# Altium project FC.PrjPcb
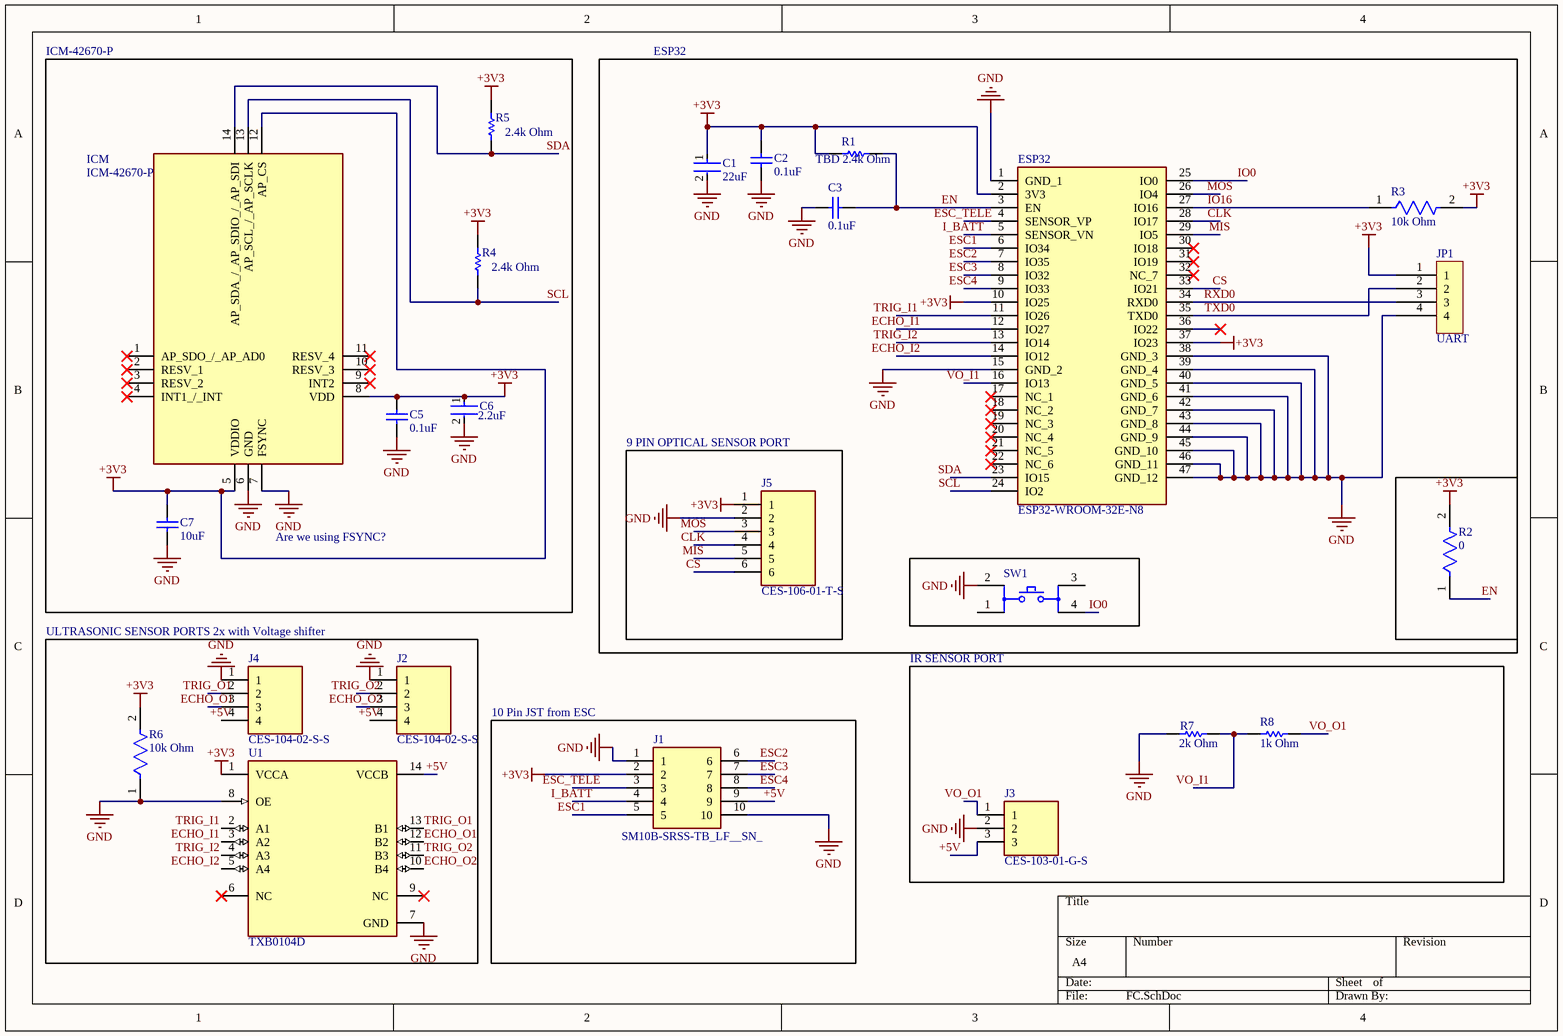
[diagram p0: FC.SchDoc]
1 sheet, 24 parts. Net scope: global (net labels, ports and power ports of the same name join across sheets).
Board file: FC.PcbDoc

## Sheet FC.SchDoc
size A4

### Parts
C1  22uF  [FP-CL10-IPC_B]
C2  0.1uF  [CAPC0805(2012)145_M]
C3  0.1uF  [CAPC0805(2012)145_M]
C5  0.1uF  [CAPC0805(2012)145_M]
C6  2.2uF  [FP-CC0603-DA-MFG]
C7  10uF  [CAPC2013X140X50ML20T25]
ESP32  ESP32-WROOM-32E-N8  [ESP32WROOM32EN8]
ICM  ICM-42670-P  [ICM42670P]
J1  SM10B-SRSS-TB_LF__SN_  [SM10B-SRSS-TB]
J2  CES-104-02-S-S  [CES-104-XX-Y-S]
J3  CES-103-01-G-S  [CES-103-XX-Y-S]
J4  CES-104-02-S-S  [CES-104-XX-Y-S]
J5  CES-106-01-T-S  [CES-106-XX-Y-S]
JP1  UART  [HDR Male1~4 2.54mm]
R1  TBD 2.4k Ohm  [RESC1608X55X30ML15T15]
R2  0  [FP-AC0603-IPC_A]
R3  10k Ohm  [FP-AC0603-IPC_A]
R4  2.4k Ohm  [RESC1608X55X30ML15T15]
R5  2.4k Ohm  [RESC1608X55X30ML15T15]
R6  10k Ohm  [FP-AC0603-IPC_A]
R7  2k Ohm  [RESC3116X65X40ML10T20]
R8  1k Ohm  [RESC3116X65X40ML10T20]
SW1  (no value)  [FP-TL3301AF160QG-MFG]
U1  TXB0104D  [FP-D0014A-IPC_A]

### Blocks framed on the sheet
ESP32: C1-C3 ESP32 JP1 R1-R3 SW1
9 PIN OPTICAL SENSOR PORT: J5
ULTRASONIC SENSOR PORTS 2x with Voltage shifter: J2 J4 R6 U1
IR SENSOR PORT: J3 R7 R8
10 Pin JST from ESC: J1

### Nets
+3V3: C1.1 C2.2 C5.2 C6.1 C7.2 ESP32.2(3V3) ESP32.10(IO25) ESP32.37(IO23) ICM.5(VDDIO) ICM.8(VDD) ICM.12(AP_CS) J1.2 J5.1 JP1.1 R1.2 R2.2 R3.2 R4.2 R5.1 R6.2 U1.1(VCCA)
GND: C1.2 C2.1 C3.2 C5.1 C6.2 C7.1 ESP32.1(GND_1) ESP32.15(GND_2) ESP32.38(GND_3) ESP32.39(GND_4) ESP32.40(GND_5) ESP32.41(GND_6) ESP32.42(GND_7) ESP32.43(GND_8) ESP32.44(GND_9) ESP32.45(GND_10) ESP32.46(GND_11) ESP32.47(GND_12) ICM.6(GND) ICM.7(FSYNC) J1.1 J1.10 J2.1 J3.2 J4.1 J5.2 JP1.4 R6.1 R7.1 SW1.2 U1.7(GND) U1.8(OE)
+5V: J1.9 J2.4 J3.3 J4.4 U1.14(VCCB)
CLK: ESP32.28(IO17) J5.4
CS: ESP32.33(IO21) J5.6
ECHO_I1: ESP32.12(IO27) U1.3(A2)
ECHO_I2: ESP32.14(IO12) U1.5(A4)
ECHO_O1: J4.3 U1.12(B2)
ECHO_O2: J2.3 U1.10(B4)
EN: C3.1 ESP32.3(EN) R1.1 R2.1
ESC1: ESP32.6(IO34) J1.5
ESC2: ESP32.7(IO35) J1.6
ESC3: ESP32.8(IO32) J1.7
ESC4: ESP32.9(IO33) J1.8
ESC_TELE: ESP32.4(SENSOR_VP) J1.3
I_BATT: ESP32.5(SENSOR_VN) J1.4
IO0: ESP32.25(IO0) SW1.4
IO16: ESP32.27(IO16) R3.1
MIS: ESP32.29(IO5) J5.5
MOS: ESP32.26(IO4) J5.3
RXD0: ESP32.34(RXD0) JP1.3
SCL: ESP32.24(IO2) ICM.13(AP_SCL_/_AP_SCLK) R4.1
SDA: ESP32.23(IO15) ICM.14(AP_SDA_/_AP_SDIO_/_AP_SDI) R5.2
TRIG_I1: ESP32.11(IO26) U1.2(A1)
TRIG_I2: ESP32.13(IO14) U1.4(A3)
TRIG_O1: J4.2 U1.13(B1)
TRIG_O2: J2.2 U1.11(B3)
TXD0: ESP32.35(TXD0) JP1.2
VO_I1: ESP32.16(IO13) R7.2 R8.1
VO_O1: J3.1 R8.2

Not connected (* = marked no-connect by the designer): ESP32 17(NC_1)* 18(NC_2)* 19(NC_3)* 20(NC_4)* 21(NC_5)* 22(NC_6)* 30(IO18)* 31(IO19)* 32(NC_7)* 36(IO22)*; ICM 1(AP_SDO_/_AP_AD0)* 2(RESV_1)* 3(RESV_2)* 4(INT1_/_INT)* 9(INT2)* 10(RESV_3)* 11(RESV_4)*; SW1 1 3; U1 6(NC)* 9(NC)*

### Notes on the sheet
- ICM-42670-P
- Are we using FSYNC?

### Library data of the parts
C1 = CMP-13271-002500-1: Cap Ceramic 22uF 6.3V X5R ±20% Pad SMD 0603 +85°C T/R
C2 C3 C5 = CMP-1036-04429-1: CAP 100nF 100V ±10% 0805 (2012 Metric) Thickness 1.45mm SMD; Tolerance: Â±10%; Case-Metric: 2012; Case-EIA: 0805; Rated Voltage: 100 V; Max Thickness: 1.45 mm; Technology: SMT; Value: 100nF
C6 = CMP-03422-000187-1: CC0603 2.2 uF X5R 10.00% 16 V; Manufacturer: YAGEO; Manufacturer Part Number: CC0603KPX5R7BB225; Voltage Rating: 16 V; Material: Ceramic; Tolerance: 0.1; Temperature Coefficient: 15%; ComponentLink2Description: Datasheet; Device Class L3: Ceramic Capacitors; Temperature Characteristic: X5R; Package: CC0603-DA; Automotive: No; Device Class L1: Passive Components; ComponentLink2URL: http://www.yageo.com/documents/recent/UPY-GPHC_X7R_6.3V-to-50V_18.pdf; Value: 2.2 uF; RoHS: TRUE; Height: 0.9mm; Temperature Range High: +125°C; Footprint Url: http://www.yageo.com/exep/pages/download/literatures/UPY-C_GEN_24.pdf; Lead Free: Yes; Temperature Range Low: -55°C; Capacitance: 2.2 uF; Octopart: https://octopart.com/cc0603kpx5r7bb225-yageo-91091799; Device Class L2: Capacitors; Voltage: 16 V; Temperature: -55°C to +125°C; Category: Cap
C7 = CMP-2007-04644-1: Part Number: 08056D106KAT4A; Manufacturer: AVX Interconnect / Elco
ESP32 = ESP32-WROOM-32E-N8: WiFi Modules - 802.11 SMD Module ESP32-WROOM-32E, ESP32-D0WD-V3, 8 MB SPI flash, PCB antenna; Manufacturer_Name: Espressif Systems; Geometry.Height: 3.25mm; Mouser Part Number: 356-ESP32WRM32E164PH; Mouser Price/Stock: https://www.mouser.co.uk/ProductDetail/Espressif-Systems/ESP32-WROOM-32E-N8?qs=Li%252BoUPsLEnsLnZW%252BGLgUhw%3D%3D; Manufacturer_Part_Number: ESP32-WROOM-32E-N8; Datasheet Link: https://www.google.com/url?sa=t&rct=j&q=&esrc=s&source=web&cd=&ved=2ahUKEwjLw4ysybv2AhXFzIUKHZUbB64QFnoECCwQAQ&url=https%3A%2F%2Fwww.espressif.com%2Fsites%2Fdefault%2Ffiles%2Fdocumentation%2Fesp32-wroom-32e_esp32-wroom-32ue_datasheet_en.pdf&usg=AOvVaw1xSL; Supplier 1: Mouser; Supplier Part Number 1: 356-ESP32WRM32E164PH
ICM = ICM-42670-P: Integrated Circuit; Manufacturer_Name: TDK; Datasheet Link: https://3cfeqx1hf82y3xcoull08ihx-wpengine.netdna-ssl.com/wp-content/uploads/2021/07/DS-000451-ICM-42670-P-v1.0.pdf; Manufacturer_Part_Number: ICM-42670-P; Mouser Part Number: 410-ICM-42670-P; Mouser Price/Stock: https://www.mouser.co.uk/ProductDetail/TDK-InvenSense/ICM-42670-P?qs=iLbezkQI%252BsgK8sMF+5V7fQQ%3D%3D; Arrow Part Number: ICM-42670-P; Arrow Price/Stock: https://www.arrow.com/en/products/icm-42670-p/invensense?utm_currency=USD&region=nac; Supplier 1: Mouser; Supplier Part Number 1: 410-ICM-42670-P
J1 = CMP-022-000000-1: Connector; Manufacturer_Part_Number: SM10B-SRSS-TB(LF)(SN); Manufacturer_Name: JST (JAPAN SOLDERLESS TERMINALS); Arrow Price/Stock: https://www.arrow.com/en/products/sm10b-srss-tb-lf-sn/jst-manufacturing?utm_currency=USD&region=europe; Datasheet Link: http://www.jst-mfg.com/product/pdf/eng/eSR.pdf; Mouser Price/Stock: https://www.mouser.co.uk/ProductDetail/JST-Commercial/SM10B-SRSS-TBLFSN?qs=QpmGXVUTftHkZAI%2F8hE40w%3D%3D; Arrow Part Number: SM10B-SRSS-TB(LF)(SN); Mouser Part Number: 306-SM10BSRSSTBLFSN; Design Item ID: SM10B-SRSS-TB_LF__SN_; Source: SM10B-SRSS-TB_LF__SN.SchLib
J2 J4 = CES-104-02-S-S: Connector; Manufacturer_Name: SAMTEC; Datasheet Link: http://suddendocs.samtec.com/prints/ces-1xx-xx-x-s-xx-mkt.pdf; Manufacturer_Part_Number: CES-104-02-S-S; Supplier 1: Mouser; Supplier Part Number 1: 200-CES10402SS
J3 = CES-103-01-G-S: Connector; Manufacturer_Name: SAMTEC; Datasheet Link: http://suddendocs.samtec.com/prints/ces-1xx-xx-x-s-xx-mkt.pdf; Manufacturer_Part_Number: CES-103-01-G-S; Supplier 1: Mouser; Supplier Part Number 1: 200-CES10301GS
J5 = CES-106-01-T-S: Connector; Manufacturer_Name: SAMTEC; Datasheet Link: http://suddendocs.samtec.com/prints/ces-1xx-xx-x-s-xx-mkt.pdf; Manufacturer_Part_Number: CES-106-01-T-S; Mouser Part Number: 200-CES10601TS; Mouser Price/Stock: https://www.mouser.co.uk/ProductDetail/Samtec/CES-106-01-T-S?qs=0lQeLiL1qybhMEQittjDMQ%3D%3D; Arrow Part Number: CES-106-01-T-S; Arrow Price/Stock: https://www.arrow.com/en/products/ces-106-01-t-s/samtec?region=nac; Supplier 1: Mouser; Supplier Part Number 1: 200-CES10601TS
JP1 = CMP-022-000001-1: CONN HEADER VERT 4POS 2.54MM; Manufacturer: Amphenol FCI; Gender: Male; Number of Contacts: 4; Contact Post Length: 3.05mm; Voltage Rating: 1.5kV; Current Rating: 3A; Connector Type: Male Pin; Insulation Resistance: 5GR; Source: 68001-204HLF.Schlib; ComponentLink2URL: https://datasheet.ciiva.com/726/68000-726529.pdf?src-supplier=Digi-Key; Contact Material: Bronze; Radiation Hardening: No; ComponentLink2Description: https://datasheet.ciiva.com/726/68000-726529.pdf?src-supplier=Digi-Key; Max Operating Temperature: 125°C; Manufacturer Part Number: 68001-204HLF; ComponentLink1Description: https://datasheet.ciiva.com/5164/68000-274255-5164127.pdf?src-supplier=Mouser; Termination: Solder; Color: Black; Min Operating Temperature: -65°C; Pitch: 2.54mm; Orientation: Straight; Pricing 1: 1=0,38000, 10=0,35700, 100=0,25010, 500=0,21442, 1000=0,17868, 5000=0,15315, 10000=0,14294 (USD); Package Quantity: 100; Housing Material: Thermoplastic; Mount: Through Hole; Category: Headers and Wire Housings; Design Item ID: 68001-204HLF; Contact Gender: Male; Number of Rows: 1; Packaging: Bulk; Number of Positions: 4; Contact Plating: Gold,GXT; ComponentLink1URL: https://datasheet.ciiva.com/5164/68000-274255-5164127.pdf?src-supplier=Mouser; RoHS: Yes; Stock 1: 2857; Flammability Rating: UL94 V-0; Contact Mating Length: 0.23inch
R1 R4 R5 = CMP-2000-00361-1: Manufacturer: Panasonic; Part Number: ERJ-3EKF2401V
R2 R3 R6 = CMP-03412-040683-1: RES 10kΩ 5.00% 0.2W 0603
R7 = CMP-2003-04932-1: Part Number: RC1206FR-102KL; Manufacturer: Yageo
R8 = CMP-2003-04958-1: Part Number: RC1206JR-101KL; Manufacturer: Yageo
SW1 = CMP-17879-000012-1: SWITCH TACTILE SPST-NO 0.05A 12V; Actuator Type: Standard; Current Rating: 50mA; Contact Resistance: 100mR; Max Voltage Rating (DC): 50V; Actuator Length: 1.4mm; Electrical Life: 100000Cycles; Throw Configuration: SPST; Switch Travel: 0.25mm; Operating Force: 160gf; Switch Function: Off-Mom; Actuator Material: Nylon; Illumination Type: Non-Illuminated; Orientation: Straight; Lead Free: Lead Free; Contact Material: Silver; Series: TL3301; Mount: Surface Mount; Voltage Rating: 50V; REACH SVHC: No SVHC; Voltage Rating (DC): 12V; Packaging: Tape and Reel; Termination: Gull Wing; RoHS Compliant: Yes; Min Operating Temperature: -20°C; Package Quantity: 1000; Mechanical Life: 100000Cycles; Contact Plating: Silver; Max Operating Temperature: 70°C; Insulation Resistance: 100MR
U1 = CMP-04899-000034-1: IC TRNSLTR BIDIRECTIONAL 14SOIC; Number of Circuits: 1; Max Supply Voltage: 5.5V; Output Current: 20uA; Turn-On Delay Time: 7.4ns; Number of Channels: 4; Output Type: 3-STATE; Logic Function: Translator; Nominal Supply Current: 5uA; Propagation Delay: 4ns; Min Supply Voltage: 1.2V; Data Rate: 100Mbps; Quiescent Current: 3.5uA; High Level Output Current: -20uA; Length: 8.65mm; Case/Package: SOIC; Number of Pins: 14; Lead Free: Lead Free; Package Quantity: 50; Series: -; Min Operating Temperature: -40°C; Radiation Hardening: No; Height: 1.58mm; Low Level Output Current: 20uA; Max Operating Temperature: 85°C; RoHS Compliant: Yes; Packaging: Rail/Tube; Width: 3.91mm; Mount: Surface Mount; Weight: 0.004564oz; Number of Bits: 4; Number of Inputs: 4; REACH SVHC: No SVHC